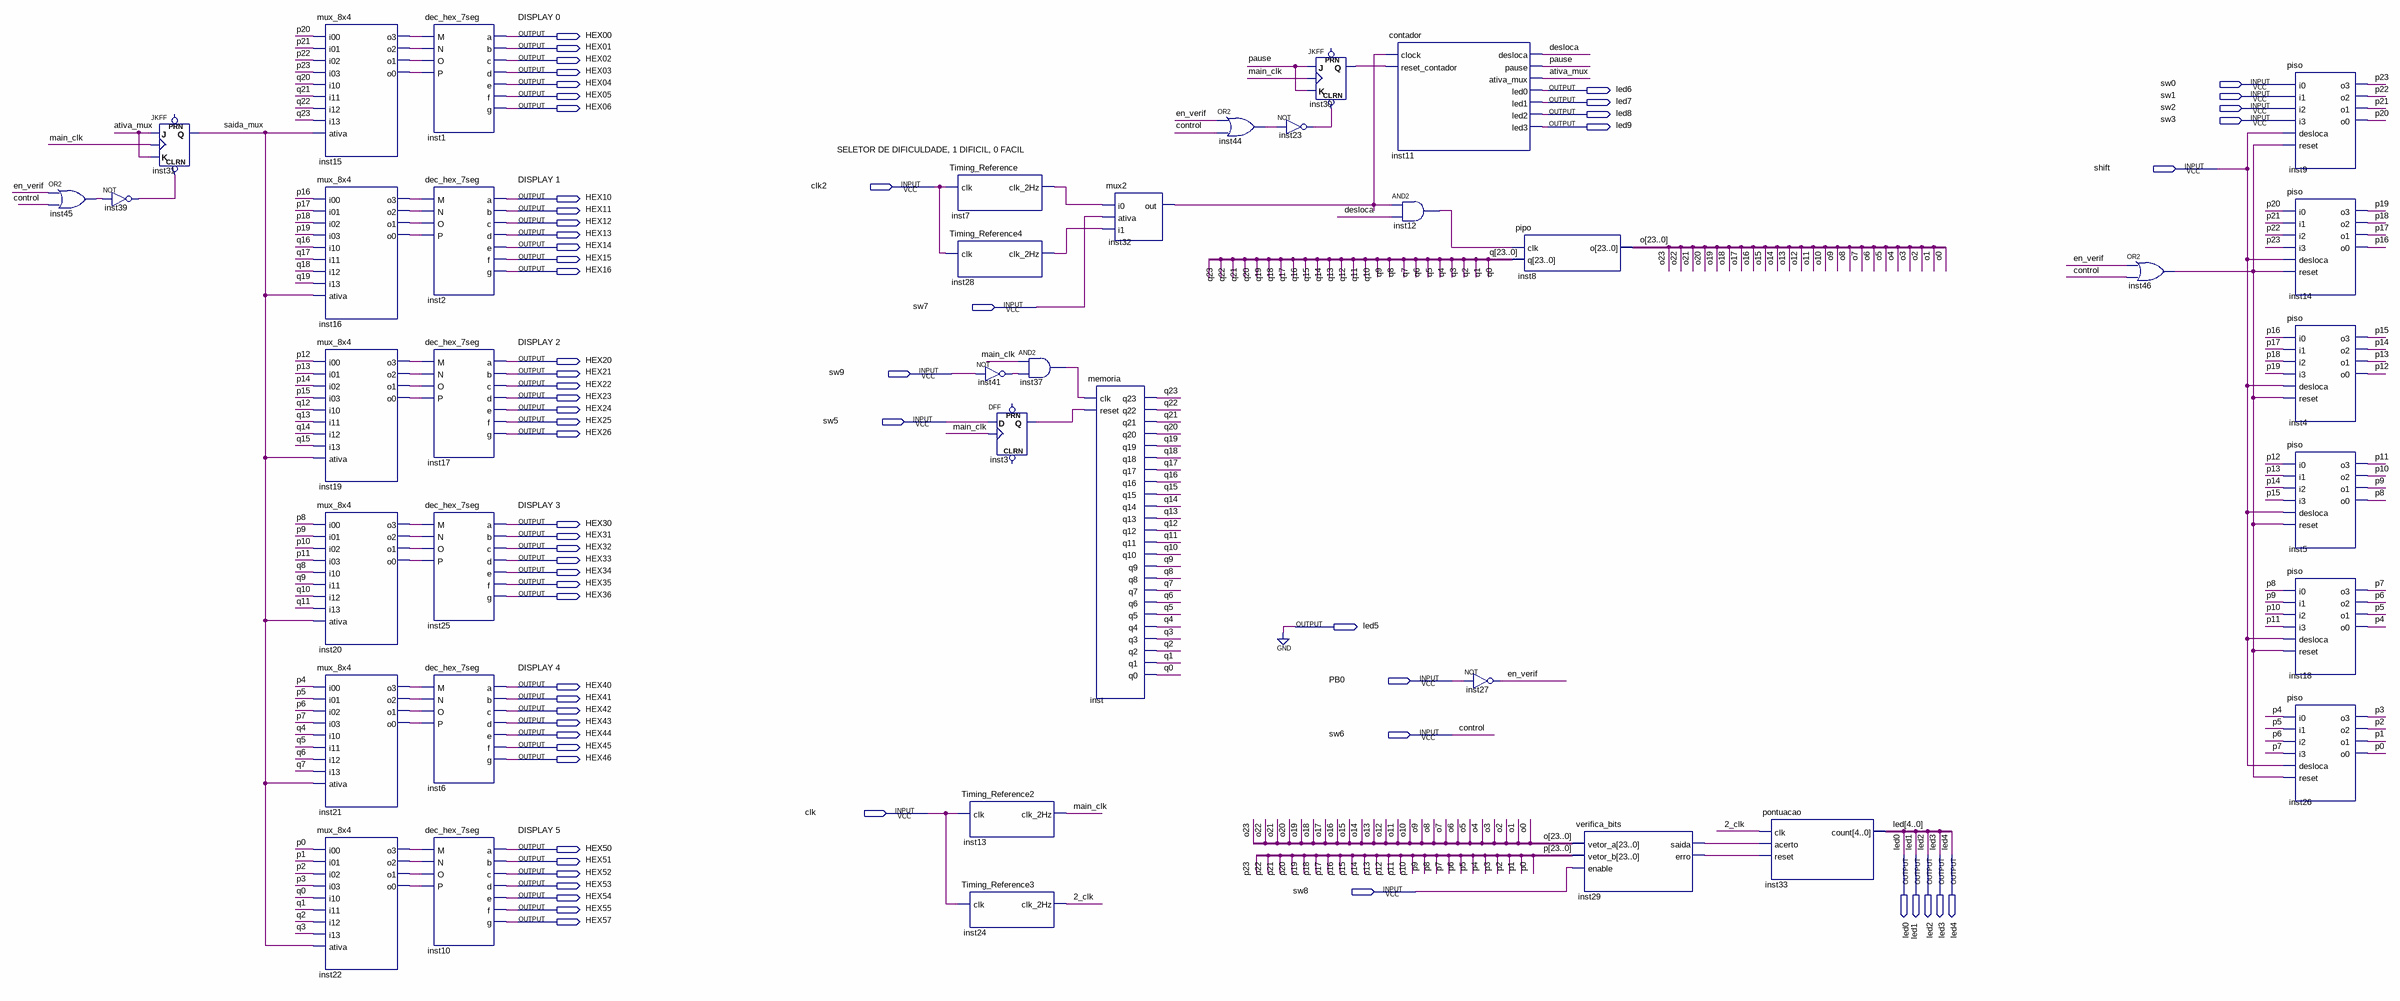
[diagram p0: schematic sheet]
// Quartus schematic proj_final.bdf as structural Verilog: 40 symbols, 65 pins
module proj_final (
  input  sw0,
  input  sw1,
  input  sw2,
  input  sw3,
  input  shift,
  input  clk2,
  input  sw7,
  input  sw9,
  input  sw5,
  input  PB0,
  input  sw6,
  input  clk,
  input  sw8,
  output HEX00,
  output HEX01,
  output HEX02,
  output HEX03,
  output HEX04,
  output led6,
  output HEX05,
  output led7,
  output HEX06,
  output led8,
  output led9,
  output HEX10,
  output HEX11,
  output HEX12,
  output HEX13,
  output HEX14,
  output HEX15,
  output HEX16,
  output HEX20,
  output HEX21,
  output HEX22,
  output HEX23,
  output HEX24,
  output HEX25,
  output HEX26,
  output HEX30,
  output HEX31,
  output HEX32,
  output HEX33,
  output HEX34,
  output HEX35,
  output HEX36,
  output led5,
  output HEX40,
  output HEX41,
  output HEX42,
  output HEX43,
  output HEX44,
  output HEX45,
  output HEX46,
  output HEX50,
  output led0,
  output led1,
  output led2,
  output led3,
  output led4,
  output HEX51,
  output HEX52,
  output HEX53,
  output HEX54,
  output HEX55,
  output HEX57
);

  wire \2_clk , ativa_mux, desloca, en_verif, inst3_q, inst7_clk_2hz, inst12_out, inst15_o0, inst15_o1,
       inst15_o2, inst15_o3, inst16_o0, inst16_o1, inst16_o2, inst16_o3, inst19_o0, inst19_o1, inst19_o2,
       inst19_o3, inst20_o0, inst20_o1, inst20_o2, inst20_o3, inst21_o0, inst21_o1, inst21_o2, inst21_o3,
       inst22_o0, inst22_o1, inst22_o2, inst22_o3, inst23_out, inst28_clk_2hz, inst29_erro, inst29_saida,
       inst30_q, inst32_out, inst37_out, inst39_out, inst41_out, inst44_out, inst45_out, inst46_out,
       main_clk, pause, saida_mux;
  wire [23:0] o, p, q;

  or inst45 (inst45_out, en_verif, sw6);
  not inst39 (inst39_out, inst45_out);
  JKFF inst31 (.CLRN(inst39_out), .K(ativa_mux), .J(ativa_mux), .CLK(main_clk), .Q(saida_mux));  // open: PRN
  mux_8x4 inst15 (
    .i00(p[20]), .i01(p[21]), .i02(p[22]), .i03(p[23]), .i10(q[20]), .i11(q[21]), .i12(q[22]), .i13(q[23]),
    .ativa(saida_mux), .o3(inst15_o3), .o2(inst15_o2), .o1(inst15_o1), .o0(inst15_o0));
  mux_8x4 inst16 (
    .i00(p[16]), .i01(p[17]), .i02(p[18]), .i03(p[19]), .i10(q[16]), .i11(q[17]), .i12(q[18]), .i13(q[19]),
    .ativa(saida_mux), .o3(inst16_o3), .o2(inst16_o2), .o1(inst16_o1), .o0(inst16_o0));
  mux_8x4 inst19 (
    .i00(p[12]), .i01(p[13]), .i02(p[14]), .i03(p[15]), .i10(q[12]), .i11(q[13]), .i12(q[14]), .i13(q[15]),
    .ativa(saida_mux), .o3(inst19_o3), .o2(inst19_o2), .o1(inst19_o1), .o0(inst19_o0));
  mux_8x4 inst20 (
    .i00(p[8]), .i01(p[9]), .i02(p[10]), .i03(p[11]), .i10(q[8]), .i11(q[9]), .i12(q[10]), .i13(q[11]),
    .ativa(saida_mux), .o3(inst20_o3), .o2(inst20_o2), .o1(inst20_o1), .o0(inst20_o0));
  mux_8x4 inst21 (
    .i00(p[4]), .i01(p[5]), .i02(p[6]), .i03(p[7]), .i10(q[4]), .i11(q[5]), .i12(q[6]), .i13(q[7]),
    .ativa(saida_mux), .o3(inst21_o3), .o2(inst21_o2), .o1(inst21_o1), .o0(inst21_o0));
  mux_8x4 inst22 (
    .i00(p[0]), .i01(p[1]), .i02(p[2]), .i03(p[3]), .i10(q[0]), .i11(q[1]), .i12(q[2]), .i13(q[3]),
    .ativa(saida_mux), .o3(inst22_o3), .o2(inst22_o2), .o1(inst22_o1), .o0(inst22_o0));
  dec_hex_7seg inst1 (
    .M(inst15_o3), .N(inst15_o2), .O(inst15_o1), .P(inst15_o0), .a(HEX00), .b(HEX01), .c(HEX02), .d(HEX03),
    .e(HEX04), .f(HEX05), .g(HEX06));
  dec_hex_7seg inst2 (
    .M(inst16_o3), .N(inst16_o2), .O(inst16_o1), .P(inst16_o0), .a(HEX10), .b(HEX11), .c(HEX12), .d(HEX13),
    .e(HEX14), .f(HEX15), .g(HEX16));
  dec_hex_7seg inst17 (
    .M(inst19_o3), .N(inst19_o2), .O(inst19_o1), .P(inst19_o0), .a(HEX20), .b(HEX21), .c(HEX22), .d(HEX23),
    .e(HEX24), .f(HEX25), .g(HEX26));
  dec_hex_7seg inst25 (
    .M(inst20_o3), .N(inst20_o2), .O(inst20_o1), .P(inst20_o0), .a(HEX30), .b(HEX31), .c(HEX32), .d(HEX33),
    .e(HEX34), .f(HEX35), .g(HEX36));
  dec_hex_7seg inst6 (
    .M(inst21_o3), .N(inst21_o2), .O(inst21_o1), .P(inst21_o0), .a(HEX40), .b(HEX41), .c(HEX42), .d(HEX43),
    .e(HEX44), .f(HEX45), .g(HEX46));
  dec_hex_7seg inst10 (
    .M(inst22_o3), .N(inst22_o2), .O(inst22_o1), .P(inst22_o0), .a(HEX50), .b(HEX51), .c(HEX52), .d(HEX53),
    .e(HEX54), .f(HEX55), .g(HEX57));
  Timing_Reference inst7 (.clk(clk2), .clk_2Hz(inst7_clk_2hz));
  Timing_Reference4 inst28 (.clk(clk2), .clk_2Hz(inst28_clk_2hz));
  not inst41 (inst41_out, sw9);
  DFF inst3 (.CLK(main_clk), .D(sw5), .Q(inst3_q));  // open: CLRN, PRN
  Timing_Reference2 inst13 (.clk(clk), .clk_2Hz(main_clk));
  Timing_Reference3 inst24 (.clk(clk), .clk_2Hz(\2_clk ));
  and inst37 (inst37_out, main_clk, inst41_out);
  memoria inst (
    .clk(inst37_out), .reset(inst3_q), .q23(q[23]), .q22(q[22]), .q21(q[21]), .q20(q[20]), .q19(q[19]),
    .q18(q[18]), .q17(q[17]), .q16(q[16]), .q15(q[15]), .q14(q[14]), .q13(q[13]), .q12(q[12]), .q11(q[11]),
    .q10(q[10]), .q9(q[9]), .q8(q[8]), .q7(q[7]), .q6(q[6]), .q5(q[5]), .q4(q[4]), .q3(q[3]), .q2(q[2]),
    .q1(q[1]), .q0(q[0]));
  mux2 inst32 (.i0(inst7_clk_2hz), .ativa(sw7), .i1(inst28_clk_2hz), .out(inst32_out));
  or inst44 (inst44_out, en_verif, sw6);
  not inst23 (inst23_out, inst44_out);
  JKFF inst30 (.CLRN(inst23_out), .K(pause), .J(pause), .CLK(main_clk), .Q(inst30_q));  // open: PRN
  contador inst11 (
    .clock(inst32_out), .reset_contador(inst30_q), .desloca(desloca), .pause(pause), .ativa_mux(ativa_mux),
    .led0(led6), .led1(led7), .led2(led8), .led3(led9));
  and inst12 (inst12_out, inst32_out, desloca);
  not inst27 (en_verif, PB0);
  pipo inst8 (.clk(inst12_out), .q(q), .o(o));
  verifica_bits inst29 (.vetor_a(o), .vetor_b(p), .enable(sw8), .saida(inst29_saida), .erro(inst29_erro));
  pontuacao inst33 (.clk(\2_clk ), .acerto(inst29_saida), .reset(inst29_erro), .count({led4, led3, led2, led1, led0}));
  or inst46 (inst46_out, en_verif, sw6);
  piso inst9 (
    .i0(sw0), .i1(sw1), .i2(sw2), .i3(sw3), .desloca(shift), .reset(inst46_out), .o3(p[23]), .o2(p[22]),
    .o1(p[21]), .o0(p[20]));
  piso inst14 (
    .i0(p[20]), .i1(p[21]), .i2(p[22]), .i3(p[23]), .desloca(shift), .reset(inst46_out), .o3(p[19]),
    .o2(p[18]), .o1(p[17]), .o0(p[16]));
  piso inst4 (
    .i0(p[16]), .i1(p[17]), .i2(p[18]), .i3(p[19]), .desloca(shift), .reset(inst46_out), .o3(p[15]),
    .o2(p[14]), .o1(p[13]), .o0(p[12]));
  piso inst5 (
    .i0(p[12]), .i1(p[13]), .i2(p[14]), .i3(p[15]), .desloca(shift), .reset(inst46_out), .o3(p[11]),
    .o2(p[10]), .o1(p[9]), .o0(p[8]));
  piso inst18 (
    .i0(p[8]), .i1(p[9]), .i2(p[10]), .i3(p[11]), .desloca(shift), .reset(inst46_out), .o3(p[7]), .o2(p[6]),
    .o1(p[5]), .o0(p[4]));
  piso inst26 (
    .i0(p[4]), .i1(p[5]), .i2(p[6]), .i3(p[7]), .desloca(shift), .reset(inst46_out), .o3(p[3]), .o2(p[2]),
    .o1(p[1]), .o0(p[0]));

  assign led5 = 1'b0;

  // Other names for the same wires on the sheet: control = sw6

  // Notes on the sheet:
  //   DISPLAY 0
  //   SELETOR DE DIFICULDADE, 1 DIFICIL, 0 FACIL
  //   DISPLAY 1
  //   DISPLAY 2
  //   DISPLAY 3
  //   DISPLAY 4
  //   DISPLAY 5
endmodule
